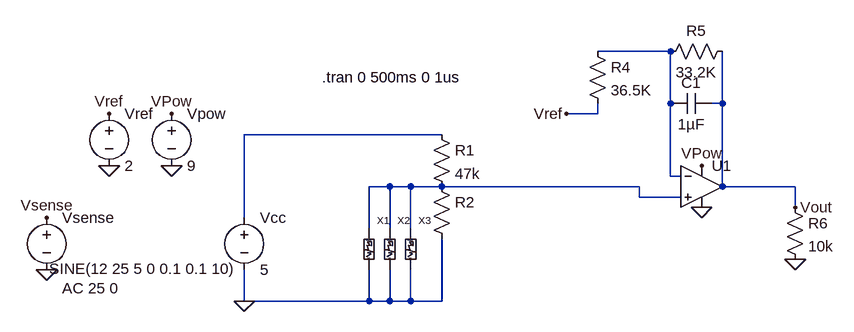
[diagram p0: schematic GSRSensor-1opamp.asc]
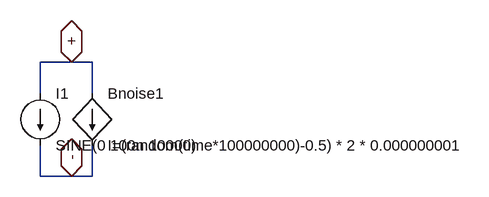
[diagram p1: sub-circuit noise.asc]
GSRSensor-1opamp.asc, the LTspice schematic file:
Version 4
SHEET 1 880 680
WIRE 192 -48 80 -48
WIRE 192 32 192 -48
WIRE 272 32 272 -48
WIRE 272 32 256 32
WIRE 80 48 80 32
WIRE 80 48 32 48
WIRE -160 80 -464 80
WIRE 192 144 192 32
WIRE 208 144 192 144
WIRE -240 160 -272 160
WIRE -208 160 -240 160
WIRE -160 160 -208 160
WIRE 144 160 -160 160
WIRE 272 160 272 32
WIRE 384 160 272 160
WIRE 144 176 144 160
WIRE 208 176 144 176
WIRE 384 192 384 160
WIRE -464 208 -464 80
WIRE -272 224 -272 160
WIRE -240 224 -240 160
WIRE -208 224 -208 160
WIRE -464 336 -464 288
WIRE -272 336 -272 288
WIRE -272 336 -464 336
WIRE -240 336 -240 288
WIRE -240 336 -272 336
WIRE -208 336 -208 288
WIRE -208 336 -240 336
WIRE -160 336 -160 240
WIRE -160 336 -208 336
FLAG -768 288 0
FLAG -672 128 0
FLAG -576 128 0
FLAG 240 192 0
FLAG -672 48 Vref
FLAG -576 48 VPow
FLAG 240 128 VPow
FLAG -464 336 0
FLAG -768 208 Vsense
FLAG 32 48 Vref
FLAG 384 192 Vout
FLAG 384 272 0
SYMBOL Opamps\\UniversalOpamp2 240 160 R0
SYMATTR InstName U1
SYMBOL voltage -576 32 R0
WINDOW 123 0 0 Left 2
WINDOW 39 0 0 Left 2
SYMATTR InstName Vpow
SYMATTR Value 9
SYMBOL voltage -768 192 R0
WINDOW 3 148 110 Bottom 2
WINDOW 123 24 124 Left 2
WINDOW 39 0 0 Left 2
SYMATTR Value SINE(12 25 5 0 0.1 0.1 10)
SYMATTR Value2 AC 25 0
SYMATTR InstName Vsense
SYMBOL voltage -672 32 R0
WINDOW 123 0 0 Left 2
WINDOW 39 0 0 Left 2
SYMATTR InstName Vref
SYMATTR Value 2
SYMBOL res -176 64 R0
SYMATTR InstName R1
SYMATTR Value 47k
SYMBOL voltage -464 192 R0
WINDOW 123 0 0 Left 2
WINDOW 39 0 0 Left 2
SYMATTR InstName Vcc
SYMATTR Value 5
SYMBOL res -176 144 R0
WINDOW 3 36 76 Invisible 2
SYMATTR Value R=limit(2k, 100k, 5k+V(Vsense)*1000)
SYMATTR InstName R2
SYMBOL res 64 -64 R0
SYMATTR InstName R4
SYMATTR Value 36.5K
SYMATTR SpiceLine tol=1 pwr=0.1
SYMBOL res 176 -32 R270
WINDOW 0 32 56 VTop 2
WINDOW 3 0 56 VBottom 2
SYMATTR InstName R5
SYMATTR Value 33.2K
SYMATTR SpiceLine tol=1 pwr=0.1
SYMBOL res 368 176 R0
SYMATTR InstName R6
SYMATTR Value 10k
SYMBOL Noise -272 256 R0
SYMATTR InstName X1
SYMBOL Noise -240 256 R0
SYMATTR InstName X2
SYMBOL Noise -208 256 R0
SYMATTR InstName X3
SYMBOL cap 192 48 R270
WINDOW 0 32 32 VTop 2
WINDOW 3 0 32 VBottom 2
SYMATTR InstName C1
SYMATTR Value 1µF
TEXT -344 -8 Left 2 !.tran 0 500ms 0 1us

noise.asc, the sub-circuit schematic file:
Version 4
SHEET 1 880 680
WIRE -16 80 -64 80
WIRE 16 80 -16 80
WIRE -64 128 -64 80
WIRE 16 128 16 80
WIRE -64 256 -64 208
WIRE -16 256 -64 256
WIRE 16 256 16 208
WIRE 16 256 -16 256
FLAG -16 80 +
IOPIN -16 80 BiDir
FLAG -16 256 -
IOPIN -16 256 BiDir
SYMBOL bi 16 128 R0
SYMATTR InstName Bnoise1
SYMATTR Value I=(random(time*100000000)-0.5) * 2 * 0.000000001
SYMBOL current -64 128 R0
WINDOW 123 24 108 Left 2
WINDOW 39 0 0 Left 2
SYMATTR InstName I1
SYMATTR Value SINE(0 100n 10000)

The netlist it stands for:
* GSRSensor-1opamp.asc
XU1 N003 N001 VPow 0 Vout level.2 Avol=1Meg GBW=10Meg Slew=10Meg ilimit=25m rail=0 Vos=0 phimargin=45 en=0 enk=0 in=0 ink=0 Rin=500Meg  ; pins IN+ IN- V+ V- OUT
Vpow VPow 0 9
Vsense Vsense 0 SINE(12 25 5 0 0.1 0.1 10) AC 25 0
Vref Vref 0 2
R1 N002 N003 47k
Vcc N002 0 5
R2 N003 0 R=limit(2k, 100k, 5k+V(Vsense)*1000)
R4 N001 Vref 36.5K tol=1 pwr=0.1
R5 N001 Vout 33.2K tol=1 pwr=0.1
R6 Vout 0 10k
XX1 0 N003 noise
XX2 0 N003 noise
XX3 0 N003 noise
C1 N001 Vout 1µF

* block symbol definitions
.subckt noise - +
Bnoise1 + - I=(random(time*100000000)-0.5) * 2 * 0.000000001
I1 + - SINE(0 100n 10000)
.ends noise

.tran 0 500ms 0 1us
.lib UniversalOpamps2.sub
.backanno
.end